# Altium schematic sheet Sheet1.SchDoc
size B
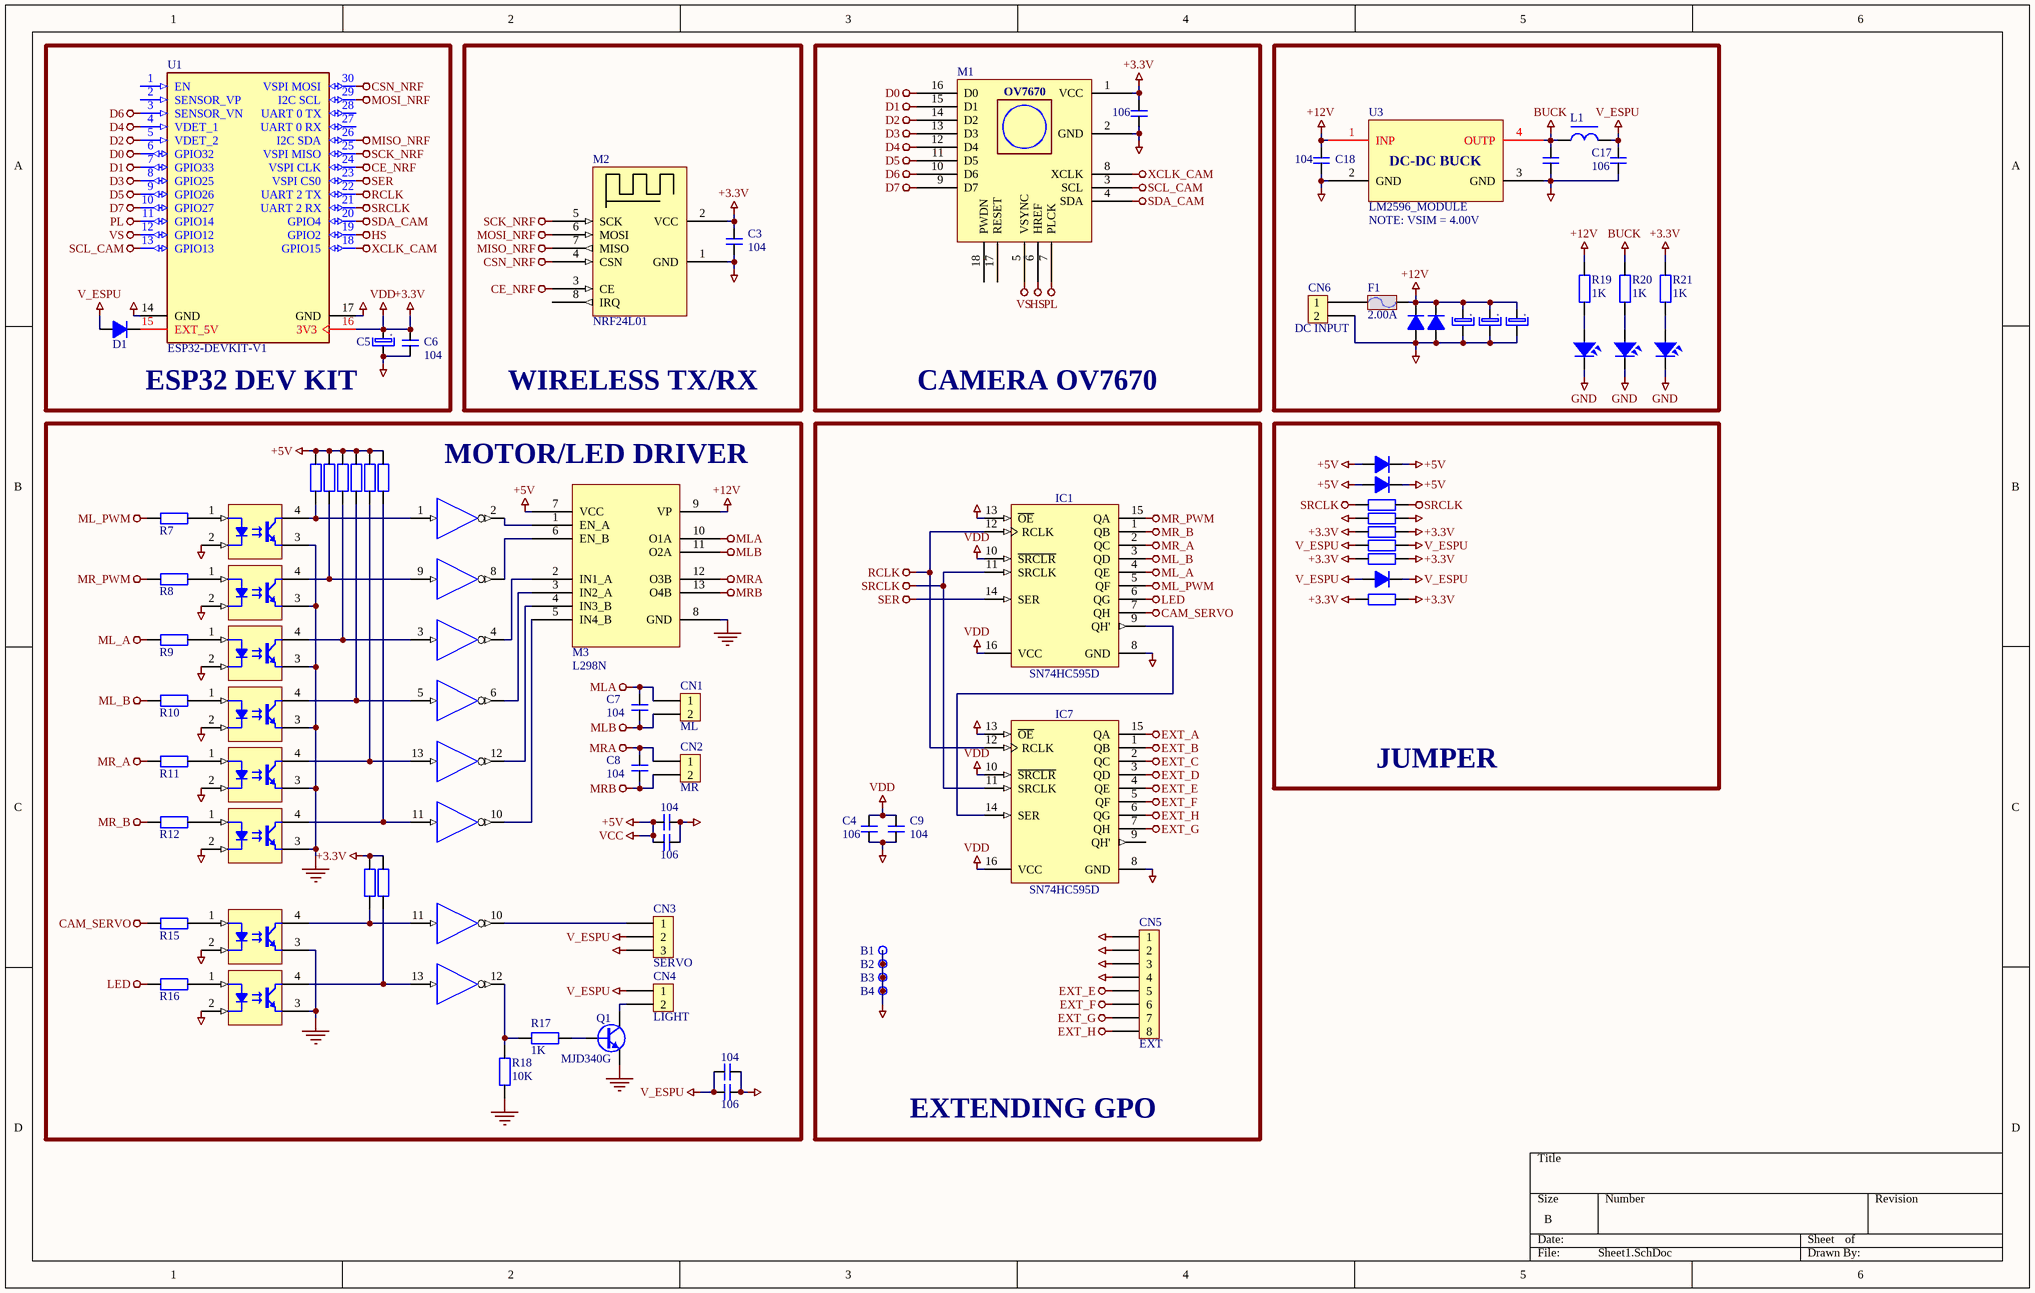
[diagram p0: Sheet1.SchDoc]

## Parts
B1  Plated Hole  [MTG300_600]  (value not drawn)
B2  Plated Hole  [MTG300_600]  (value not drawn)
B3  Plated Hole  [MTG300_600]  (value not drawn)
B4  Plated Hole  [MTG300_600]  (value not drawn)
C1  106  [CAP-SMD-0805]
C3  104  [Cap-Non-150mil]
C4  106  [CAP-SMD-0805]
C5  220uF  [Cap-P-2.5/5]  (value not drawn)
C6  104  [Cap-Non-150mil]
C7  104  [CAP-SMD-0805]
C8  104  [CAP-SMD-0805]
C9  104  [CAP-SMD-0805]
C12  104  [CAP-SMD-0805]
C13  106  [CAP-SMD-0805]
C14  470uF  [Cap-P-3.8/6.3]  (value not drawn)
C15  104  [CAP-SMD-0805]
C16  106  [CAP-SMD-0805]
C17  106  [CAP-SMD-0805]
C18  104  [Cap-Non-150mil]
C20  104  [Cap-Non-150mil]  (value not drawn)
C21  470uF  [Cap-P-3.8/6.3]  (value not drawn)
C22  470uF  [Cap-P-3.8/6.3]  (value not drawn)
CN1  ML  [KF2/5.08]
CN2  MR  [KF2/5.08]
CN3  SERVO  [JP3-DT*1]
CN4  LIGHT  [Header 2P]
CN5  EXT  [Header 8P]
CN6  DC INPUT  [KF2/5.08]
D1  SS14  [SOD 106]  (value not drawn)
D2  SS14  [SOD 106]  (value not drawn)
D3  SS14  [SOD 106]  (value not drawn)
D4  SS14  [SOD 106]  (value not drawn)
D5  SS14  [SOD 106]  (value not drawn)
D6  SS14  [SOD 106]  (value not drawn)
F1  2.00A  [Fuse-Dip1]
IC1  SN74HC595D  [SOIC127P600X175-16N]
IC2  FOD817DSD  [DIP4]  (value not drawn)
IC3  74HC14D  [SOIC127P600X175-14N]  (value not drawn)  (parts A,B,C,D,E,F of 6)
IC4  FOD817DSD  [DIP4]  (value not drawn)
IC5  FOD817DSD  [DIP4]  (value not drawn)
IC6  FOD817DSD  [DIP4]  (value not drawn)
IC7  SN74HC595D  [SOIC127P600X175-16N]
IC8  FOD817DSD  [DIP4]  (value not drawn)
IC9  FOD817DSD  [DIP4]  (value not drawn)
IC10  FOD817DSD  [DIP4]  (value not drawn)
IC11  74HC14D  [SOIC127P600X175-14N]  (value not drawn)  (parts E,F of 6)
IC12  FOD817DSD  [DIP4]  (value not drawn)
L1  470uH  [L-DIP-M-5.3]  (value not drawn)
LED1  POWER  [LED-0805]  (value not drawn)
LED2  ESP-5.0V  [LED-0805]  (value not drawn)
LED3  ESP-3.3V  [LED-0805]  (value not drawn)
M1  OV7670  [OV7670]  (value not drawn)
M2  NRF24L01  [NRF24L01P_M]
M3  L298N  [L298N_MODULE]
Q1  MJD340G  [TO228P991X239-3N-R552X520]
R1  1K  [RES-SMD-0805]  (value not drawn)
R2  1K  [RES-SMD-0805]  (value not drawn)
R3  1K  [RES-SMD-0805]  (value not drawn)
R4  1K  [RES-SMD-0805]  (value not drawn)
R5  1K  [RES-SMD-0805]  (value not drawn)
R6  1K  [RES-SMD-0805]  (value not drawn)
R7  1K  [RES-SMD-0805]  (value not drawn)
R8  1K  [RES-SMD-0805]  (value not drawn)
R9  1K  [RES-SMD-0805]  (value not drawn)
R10  1K  [RES-SMD-0805]  (value not drawn)
R11  1K  [RES-SMD-0805]  (value not drawn)
R12  1K  [RES-SMD-0805]  (value not drawn)
R13  1K  [RES-SMD-0805]  (value not drawn)
R14  1K  [RES-SMD-0805]  (value not drawn)
R15  1K  [RES-SMD-0805]  (value not drawn)
R16  1K  [RES-SMD-0805]  (value not drawn)
R17  1K  [RES-SMD-0805]
R18  10K  [RES-SMD-0805]
R19  1K  [RES-SMD-0805]
R20  1K  [RES-SMD-0805]
R21  1K  [RES-SMD-0805]
R22  0R  [RES-SMD-0805]  (value not drawn)
R23  0R  [RES-SMD-0805]  (value not drawn)
R24  0R  [RES-SMD-0805]  (value not drawn)
R25  0R  [RES-SMD-2512]  (value not drawn)
R26  0R  [RES-SMD-2512]  (value not drawn)
R27  0R  [RES-SMD-1206]  (value not drawn)
U1  ESP32-DEVKIT-V1  [MODULE_ESP32-DEVKITC-32D]
U3  LM2596_MODULE  [LM2596_MODULE]

## Blocks framed on the sheet
ESP32 DEV KIT: C5 C6 D1 U1
WIRELESS TX/RX: C3 M2
CAMERA OV7670: C1 M1
NOTE: VSIM = 4.00V: C14 C17 C18 C20-C22 CN6 D2 D3 F1 L1 LED1-LED3 R19-R21 U3
MOTOR/LED DRIVER: C7 C8 C12 C13 C15 C16 CN1-CN4 IC2-IC6 IC8-IC12 M3 Q1 R1-R18
EXTENDING GPO: B1-B4 C4 C9 CN5 IC1 IC7
JUMPER: D4-D6 R22-R27

## Nets
+3.3V: C1.2 C3.2 C4.2 C5.1 C6.2 C9.2 IC1.10(~{SRCLR}) IC1.16(VCC) IC7.10(~{SRCLR}) IC7.16(VCC) IC11.14(+3.3V) M1.1(VCC) M2.2(VCC) R13.2 R14.2 R21.2 R24.1 R24.2 R26.1 R26.2 R27.1 R27.2 U1.16(3V3)  [also labelled VDD]
+5V: C12.2 C13.2 D4.1(A) D4.2(K) D5.1(A) D5.2(K) IC3.14(VCC) M3.7(VCC) R1.2 R2.2 R3.2 R4.2 R5.2 R6.2  [also labelled VCC]
+12V: C14.1 C18.1 C21.1 C22.1 D2.2(K) D3.2(K) F1.2 M3.9(VP) R19.2 U3.1(INP)
BUCK: C20.1 L1.1 R20.2 U3.4(OUTP)
CAM_SERVO: IC1.7(QH) R15.2
CE_NRF: M2.3(CE) U1.24(VSPI_CLK)
CSN_NRF: M2.4(CSN) U1.30(VSPI_MOSI)
D0: M1.16(D0) U1.6(GPIO32)
D1: M1.15(D1) U1.7(GPIO33)
D2: M1.14(D2) U1.5(VDET_2)
D3: M1.13(D3) U1.8(GPIO25)
D4: M1.12(D4) U1.4(VDET_1)
D5: M1.11(D5) U1.9(GPIO26)
D6: M1.10(D6) U1.3(SENSOR_VN)
D7: M1.9(D7) U1.10(GPIO27)
EXT_A: IC7.15(QA)
EXT_B: IC7.1(QB)
EXT_C: IC7.2(QC)
EXT_D: IC7.3(QD)
EXT_E: CN5.5 IC7.4(QE)
EXT_F: CN5.6 IC7.5(QF)
EXT_G: CN5.7 IC7.7(QH)
EXT_H: CN5.8 IC7.6(QG)
GND: B1.1 B2.1 B3.1 B4.1 C1.1 C3.1 C4.1 C5.2 C6.1 C9.1 C12.1 C13.1 C14.2 C15.1 C16.1 C17.1 C18.2 C20.2 C21.2 C22.2 CN3.3 CN5.1 CN5.2 CN5.3 CN5.4 CN6.2 D2.1(A) D3.1(A) IC1.8(GND) IC1.13(~{OE}) IC2.2(C) IC2.3(E) IC3.7(GND) IC4.2(C) IC4.3(E) IC5.2(C) IC5.3(E) IC6.2(C) IC6.3(E) IC7.8(GND) IC7.13(~{OE}) IC8.2(C) IC8.3(E) IC9.2(C) IC9.3(E) IC10.2(C) IC10.3(E) IC11.7(GND) IC12.2(C) IC12.3(E) LED1.2 LED2.2 LED3.2 M1.2(GND) M2.1(GND) M3.8(GND) Q1.2(E) R18.1 R23.1 R23.2 U1.14(GND) U1.17(GND) U3.2(GND) U3.3(GND)
HS: M1.6(HREF) U1.19(GPIO2)
LED: IC1.6(QG) R16.2
MISO_NRF: M2.7(MISO) U1.26(I2C_SDA)
ML_A: IC1.4(QE) R9.2
ML_B: IC1.3(QD) R10.2
ML_PWM: IC1.5(QF) R7.2
MLA: C7.2 CN1.1 M3.10(O1A)
MLB: C7.1 CN1.2 M3.11(O2A)
MOSI_NRF: M2.6(MOSI) U1.29(I2C_SCL)
MR_A: IC1.2(QC) R11.2
MR_B: IC1.1(QB) R12.2
MR_PWM: IC1.15(QA) R8.2
MRA: C8.2 CN2.1 M3.12(O3B)
MRB: C8.1 CN2.2 M3.13(O4B)
PL: M1.7(PLCK) U1.11(GPIO14)
RCLK: IC1.12(RCLK) IC7.12(RCLK) U1.22(UART_2_TX)
SCK_NRF: M2.5(SCK) U1.25(VSPI_MISO)
SCL_CAM: M1.3(SCL) U1.13(GPIO13)
SDA_CAM: M1.4(SDA) U1.20(GPIO4)
SER: IC1.14(SER) U1.23(VSPI_CS0)
SRCLK: IC1.11(SRCLK) IC7.11(SRCLK) R22.1 R22.2 U1.21(UART_2_RX)
V_ESPU: C15.2 C16.2 C17.2 CN3.2 CN4.1 D1.1(A) D6.1(A) D6.2(K) L1.2 R25.1 R25.2
VS: M1.5(VSYNC) U1.12(GPIO12)
XCLK_CAM: M1.8(XCLK) U1.18(GPIO15)
NetCN3_1: CN3.1 IC11.10(OUT)
NetCN4_2: CN4.2 Q1.3(C)
NetCN6_1: CN6.1 F1.1
NetD1_2: D1.2(K) U1.15(EXT_5V)
NetIC1_9: IC1.9(QH') IC7.14(SER)
NetIC2_1: IC2.1(A) R7.1
NetIC2_4: IC2.4(C) IC3.1(IN) R1.1
NetIC3_2: IC3.2(OUT) M3.1(EN_A)
NetIC3_3: IC3.3(IN) IC5.4(C) R3.1
NetIC3_4: IC3.4(OUT) M3.2(IN1_A)
NetIC3_5: IC3.5(IN) IC6.4(C) R4.1
NetIC3_6: IC3.6(OUT) M3.3(IN2_A)
NetIC3_8: IC3.8(OUT) M3.6(EN_B)
NetIC3_9: IC3.9(IN) IC4.4(C) R2.1
NetIC3_10: IC3.10(OUT) M3.5(IN4_B)
NetIC3_11: IC3.11(IN) IC9.4(C) R6.1
NetIC3_12: IC3.12(OUT) M3.4(IN3_B)
NetIC3_13: IC3.13(IN) IC8.4(C) R5.1
NetIC4_1: IC4.1(A) R8.1
NetIC5_1: IC5.1(A) R9.1
NetIC6_1: IC6.1(A) R10.1
NetIC8_1: IC8.1(A) R11.1
NetIC9_1: IC9.1(A) R12.1
NetIC10_1: IC10.1(A) R15.1
NetIC10_4: IC10.4(C) IC11.11(IN) R13.1
NetIC11_12: IC11.12(OUT) R17.1 R18.2
NetIC11_13: IC11.13(IN) IC12.4(C) R14.1
NetIC12_1: IC12.1(A) R16.1
NetLED1_1: LED1.1 R19.1
NetLED2_1: LED2.1 R20.1
NetLED3_1: LED3.1 R21.1
NetQ1_1: Q1.1(B) R17.2

Not connected (* = marked no-connect by the designer): IC7 9(QH'); M1 17(RESET) 18(PWDN); M2 8(IRQ); U1 1(EN) 2(SENSOR_VP) 27(UART_0_RX) 28(UART_0_TX)

## Notes on the sheet
- (in symbol Cap-Pol-Dip) +
- (in symbol LM2596_MODULE) DC-DC BUCK

## Library data of the parts
B1-B4 = PLATED_HOLE3.0_PAD6.0: Single Terminal Socket; Part Description: Plated Through Hole: Hole Dia.=3.0mm Pad Dia.=6.0mm; Mounted: No; Part Number: PLATED_HOLE3.0_PAD6.0; Component Kind: Standard (No BOM); Component Type: Standard (No BOM); Pin Count: 1; Family: Plated Hole; Socket: No; SMD: No; Sense: No; Status: None; ComponentHeight: 0mm; HelpURL: Undefined; Author: CERN DEM JLC; CreateDate: 5/26/2008; LatestRevisionDate: 5/26/2008; PackageDescription: Plated Through Hole: Hole Dia.=3.0mm Pad Dia.=6.0mm
C1 C4 C9 C12 C13 C15-C17 = Cap-Non-SMD: Non-polar capacitor
C3 C6-C8 C18 C20 = Cap-Non-Dip: Non-polar capacitor
C5 C14 C21 C22 = Cap-Pol-Dip: Polarized capacitor
CN1 CN2 CN6 = KF 2
CN3 = JP3x1
CN4 = Header 2
CN5 = Header 8
D1-D6 = Diode SMD
F1 = Fuse Dip
IC1 IC7 = SN74HC595D: 8-Bit Shift Register With 3-State Output Register; Part Description: 8-Bit Shift Register With 3-State Output Registers; Manufacturer: TEXAS INSTRUMENTS; PressFit: No; Bonding: No; Part Number: SN74HC595D; Component Kind: Standard; Component Type: Standard; Device: SN74HC595D; PackageDescription: SOIC 16, Pitch 1.27mm - Body 4x10mm, IPC Medium Density; Manufacturer Part Number: SN74HC595D; Pin Count: 16; Case: SOIC16; Mounted: Yes; Socket: No; SMD: Yes; Sense: No; ComponentHeight: 1.75mm; Author: CERN DEM JLC; HelpURL: \\cern.ch\dfs\Applications\Altium\Datasheets\SN74HC595D.pdf; CreateDate: 6/5/2012; LatestRevisionDate: 6/5/2012
IC2 IC4-IC6 IC8-IC10 IC12 = FOD817DSD: Single Optocoupler; Part Description: 4-Pin High Operating Temperature Phototransistor Optocoupler; Manufacturer: FAIRCHILD SEMICONDUCTOR; PressFit: No; Bonding: No; Part Number: FOD817DSD; Component Kind: Standard; Component Type: Standard; Device: FOD817DSD; Footprint: FAIRCHILD_FOD817DSD; PackageDescription: SOIC, 2.54mm Pitch, 4 Pin, Body 6.5mm W X 4.6mm L X 4.6mm H; Manufacturer Part Number: FOD817DSD; Pin Count: 4; Case: SOIC4; Mounted: Yes; Socket: No; SMD: Yes; Sense: No; ComponentHeight: 4.6mm; HelpURL: \\cern.ch\dfs\Applications\Altium\Datasheets\FOD817DSD.pdf; Author: CERN DEM JLC; CreateDate: 7/21/2014; LatestRevisionDate: 7/21/2014
IC3 IC11 = 74HC14D: Hex Schmitt-Trigger Inverter; Part Description: Hex  Inverterting Schmitt-Trigger; Manufacturer: NXP SEMICONDUCTORS; PressFit: No; Bonding: No; Part Number: 74HC14D; Component Kind: Standard; Component Type: Standard; Device: 74HC14D; PackageDescription: SOIC 14, Pitch 1.27mm - Body 4x8.75mm, IPC Medium Density; Manufacturer Part Number: 74HC14D; Pin Count: 14; Case: SOIC14; Mounted: Yes; Socket: No; SMD: Yes; Sense: No; ComponentHeight: 1.75mm; Author: CERN DEM JLC; HelpURL: \\cern.ch\dfs\Applications\Altium\Datasheets\74HC14D.pdf; CreateDate: 8/26/2014; LatestRevisionDate: 8/26/2014
L1 = IND-DIP-1: Inductor; Value: 150 mH
LED1-LED3 = LED_SMD
Q1 = MJD340G: NPN Transistor; Part Description: 300V 500mA 15W NPN High Voltage Power Transistor; Manufacturer: ON SEMICONDUCTOR; PressFit: No; Bonding: No; Part Number: MJD340G; Component Kind: Standard; Component Type: Standard; Device: MJD340G; PackageDescription: TO-252AA DPAK TO, 2.28mm pitch; 2 pin,9.905mm L X 6.095mm W X 2.39mm H body, IPC Medium Density; Manufacturer Part Number: MJD340G; Pin Count: 3; Case: DPAK; Mounted: Yes; Socket: No; SMD: Yes; Sense: No; ComponentHeight: 2.38mm; HelpURL: \\cern.ch\dfs\Applications\Altium\Datasheets\MJD340G.pdf; Author: CERN DEM JLC; CreateDate: 9/23/2014; LatestRevisionDate: 9/23/2014
R1-R27 = Res 1/4W: Resistor 1/4W
U1 = ESP32-DEVKIT-V1: - Transceiver; 802.11 b/g/n _Wi-Fi, WiFi, WLAN_, Bluetooth® Smart Ready 4.x Dual Mode For Use With ESP-WROOM-32; MF: Espressif Systems; MP: ESP32-DEVKITC-32D; Package: None; Price: None; Availability: Unavailable; SnapEDA_Link: https://www.snapeda.com/parts/ESP32-DEVKITC-32D/Espressif%20Systems/view-part/2777395/?ref=snap; Value: *
U3 = LM2596_MODULE: ComponentLink1Description: DATASHEET; ComponentLink1URL: http://tpelectronic.ir/datasheets/20150123144301750.pdf